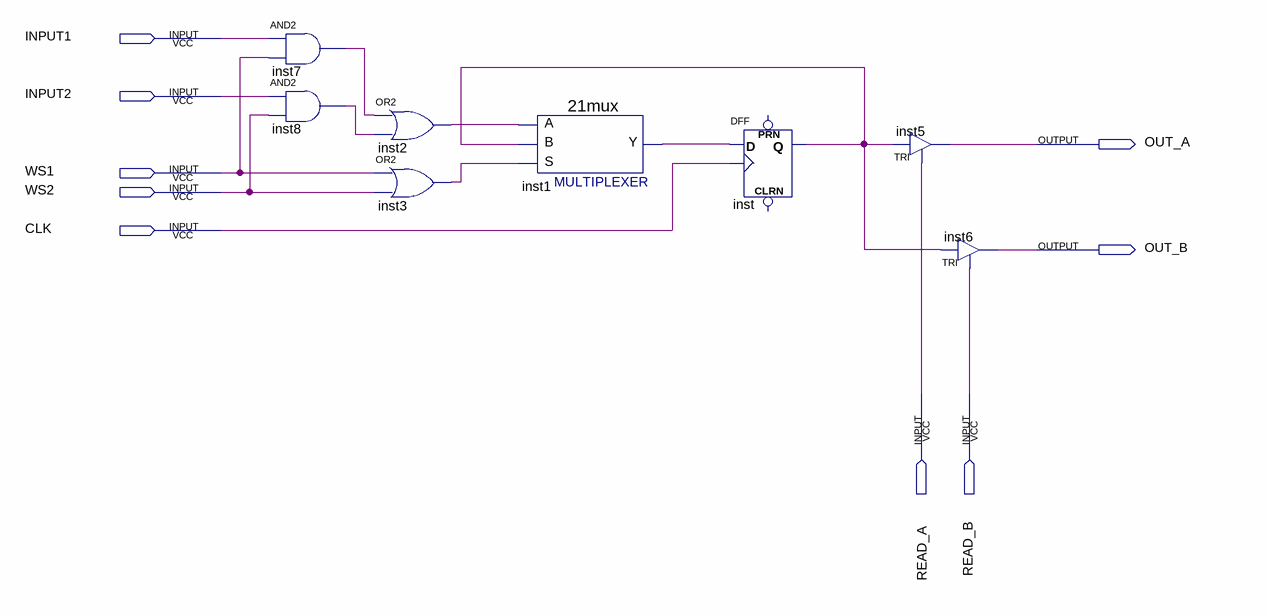
[diagram p0: schematic sheet]
// Quartus schematic RFC.bdf as structural Verilog: 8 symbols, 9 pins
module RFC (
  input  INPUT1,
  input  INPUT2,
  input  WS1,
  input  WS2,
  input  CLK,
  input  READ_A,
  input  READ_B,
  output OUT_A,
  output OUT_B
);

  wire inst1_y, inst2_out, inst3_out, inst7_out, inst8_out, inst_q;

  and inst7 (inst7_out, INPUT1, WS1);
  and inst8 (inst8_out, INPUT2, WS2);
  or inst2 (inst2_out, inst7_out, inst8_out);
  or inst3 (inst3_out, WS1, WS2);
  \21mux  inst1 (.S(inst3_out), .B(inst_q), .A(inst2_out), .Y(inst1_y));
  DFF inst (.CLK(CLK), .D(inst1_y), .Q(inst_q));  // open: CLRN, PRN
  TRI inst5 (.IN(inst_q), .OE(READ_A), .OUT(OUT_A));
  TRI inst6 (.IN(inst_q), .OE(READ_B), .OUT(OUT_B));
endmodule
